# Altium schematic sheet Sheet_switch.SchDoc
size A; SheetNumber: 1; SheetTotal: 1
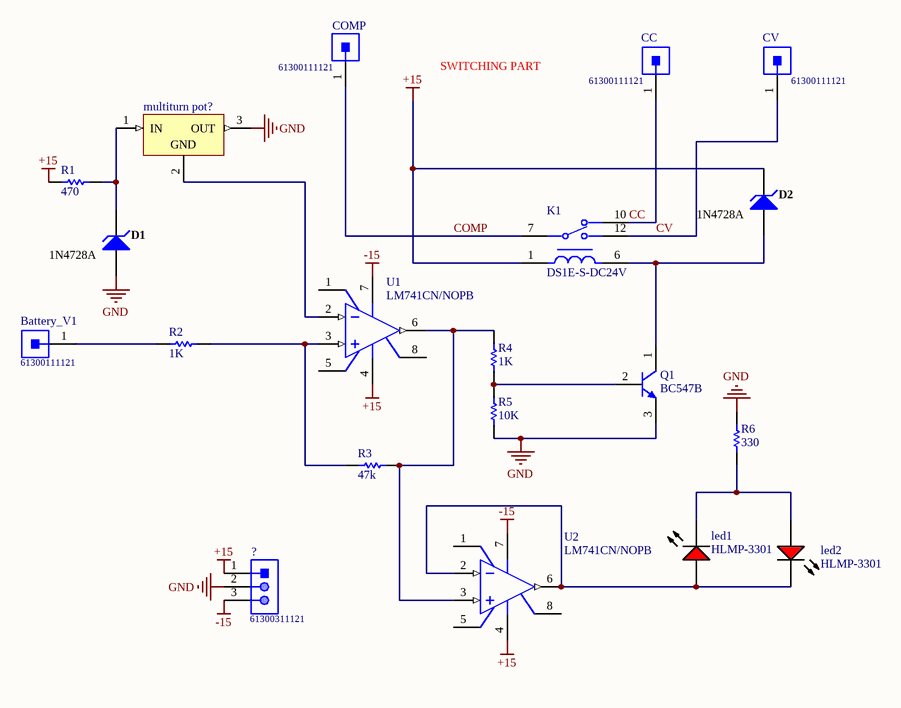
[diagram p0: Sheet_switch.SchDoc]

## Parts
?  61300311121  [61300311121]
Battery_V1  61300111121  [61300111121]
CC  61300111121  [61300111121]
COMP  61300111121  [61300111121]
CV  61300111121  [61300111121]
D1  1N4728A  [FAIR-DO-41-2_V]
D2  1N4728A  [FAIR-DO-41-2_V]
K1  DS1E-S-DC24V  [FP-DS1E-MFG]
led1  HLMP-3301  [AVAG-HLMP-3301-2]
led2  HLMP-3301  [AVAG-HLMP-3301-2]
multiturn_pot?  (no value)  [FAIR-TO-220-3]
Q1  BC547B  [ONSC-TO-92-3-29-11]
R1  470  [RESA60-630X240]
R2  1K  [RESA60-630X240]
R3  47k  [RESA60-630X240]
R4  1K  [RESA60-630X240]
R5  10K  [RESA60-630X240]
R6  330  [RESA60-630X240]
U1  LM741CN/NOPB  [P0008A]
U2  LM741CN/NOPB  [P0008A]

## Nets
+15: ?.1 D2.2(K) K1.1 R1.1 U1.4(V-) U2.4(V-)
-15: ?.3 U1.7(V+) U2.7(V+)
GND: ?.2 D1.1(A) multiturn_pot?.3(OUT) Q1.3(E) R5.1 R6.2
CC: CC.1 K1.10
COMP: COMP.1 K1.7
CV: CV.1 K1.12
NetBattery_V1_1: Battery_V1.1 R2.1
NetD1_2: D1.2(K) multiturn_pot?.1(IN) R1.2
NetD2_1: D2.1(A) K1.6 Q1.1(C)
Netled1_1: led1.1(K) led2.2(A) R6.1
Netled1_2: led1.2(A) led2.1(K) U2.2(IN-) U2.6(OUT)
Netmultiturn_pot?_2: multiturn_pot?.2(GND) U1.2(IN-)
NetQ1_2: Q1.2(B) R4.1 R5.2
NetR2_2: R2.2 R3.1 U1.3(IN+)
NetR3_2: R3.2 R4.2 U1.6(OUT) U2.3(IN+)

Not connected (* = marked no-connect by the designer): U1 1(OFS_NULL) 5(OFS_NULL) 8(NC); U2 1(OFS_NULL) 5(OFS_NULL) 8(NC)

## Notes on the sheet
- SWITCHING PART

## Library data of the parts
? = CMP-1502-01062-1: THT Vertical Pin Header WR-PHD, Pitch 2.54 mm, Single Row, 3 pins; Manufacturer: Wurth Elektronik; Withstanding Voltage: 500VAC; Working Voltage: 250VAC; Rated Current: 3A; Pitch: 2.54mm; Pin Number: 3; Gender: Male; Contact Resistance: 20mOhm; Package Reference: 61300311121; Manufacturer URL: http://www.we-online.de; Datasheet URL: https://katalog.we-online.de/em/datasheet/6130xx11121.pdf; Operating Temperature: -40to105degC; Part Number: 61300311121; Orientation: Vertical; Packaging: Bag; Row Number: Single; Mounting Technology: THT; Publisher: WurthElektronik
Battery_V1 CC COMP CV = CMP-1502-01058-1: THT Vertical Pin Header WR-PHD, Pitch 2.54 mm, Single Row, 1 pins; Manufacturer: Wurth Elektronik; Gender: Male; Working Voltage: 250VAC; Withstanding Voltage: 500VAC; Pin Number: 1; Contact Resistance: 20mOhm; Rated Current: 3A; Pitch: 2.54mm; Mounting Technology: THT; Datasheet URL: https://katalog.we-online.de/em/datasheet/6130xx11121.pdf; Manufacturer URL: http://www.we-online.de; Operating Temperature: -40to105degC; Publisher: WurthElektronik; Part Number: 61300111121; Row Number: Single; Package Reference: 61300111121; Orientation: Vertical; Packaging: Bag
D1 D2 = CMP-0892-00028-1: Zener Diode, 3.3V, 1W, 5%, -65 to 200 degC, 2-Pin DO-41, Body 2.72 x 5.2 mm, RoHS; Manufacturer: Fairchild Semiconductor; PD (W): 1; VZ (Max.) (V): 3.465; IR (uA): 100; ZZ (Max) (ohm): 10; Test Current IZ (mA): 76; VZ (Min.) (V): 3.135; DatasheetVersion: Rev. H3; Tolerance: 5%; ComponentLink3URL: http://www.fairchildsemi.com/dwg/DO/DO41A.pdf; ComponentLink2Description: Datasheet; PackageDescription: 2-Pin Axial leaded, Body 2.72 x 5.2 mm, Lead Spread 25.4 mm; PartNumber: 1N4728A; Operating and Storage Temperature Range: -65 to 200 degC; Mounting Technology: Through Hole; ComponentLink3Description: Package Specification; PackageReference: DO-41-2; ComponentLink1URL: http://www.fairchildsemi.com/; RoHS: TRUE; ComponentLink1Description: Manufacturer URL; ComponentLink2URL: http://www.fairchildsemi.com/ds/1N/1N4744A.pdf; PackageVersion: Rev. 2
K1 = CMP-05607-000039-1: RELAY GEN PURPOSE SPDT 2A 24VDC; Max Current Rating: 3A; Coil Current: 8.3mA; Relay Type: General Purpose; Coil Type: Non-Latching; Voltage Rating (AC): 250V; Coil Power: 200mW; Life (Hours): 500000Hour; Power Rating: 60W; Voltage Rating (DC): 220V; Coil Voltage (DC): 24V; Approvals: UL; Rise Time: 3ms; Operate Time: 10ms; Release Time: 5ms; Coil Resistance: 2.88kR; Number of Pins: 5; Series: DS; REACH SVHC: No SVHC; Depth: 9.9mm; Contact Material: Gold; Package Quantity: 50; Mount: Through Hole; Throw Configuration: SPDT; Max Voltage Rating (AC): 250V; Max Voltage Rating (DC): 220V; Max Operating Temperature: 70°C; Height: 9.9mm; Case/Package: DIP; Radiation Hardening: No; Packaging: Rail/Tube; Min Operating Temperature: -40°C; Current Rating: 2A; Weight: 3g; Contact Current Rating: 3A; Power Consumption: 200mW; Length: 15mm; RoHS Compliant: Yes; Lead Free: Lead Free; Width: 9.9mm; Termination: PC Pin
led1 led2 = CMP-2000-06411-1: T-1 3/4 (5 mm) Diffused LED Lamp, 1.9 V, -40 to 100 degC, 2-Pin THD, RoHS, Bulk; Manufacturer: Avago; Forward Current: 25mA; Forward Voltage: 2.4V; Peak Wavelength: 635nm; Shape Type: Circular; High Brightness: No; Main Category: StandardLED; Test Current (It): 10mA; Dominant Wave Length: 626nm; Number of  Elements: 1; Reverse Voltage: 5V; Chip Material: GaP; Product Height (mm): 9.19mm; Lens Type: ColoredDiffused; Viewing Angle: 60deg; Type: Uni-Color; Emitting Color: Red; Luminous Intensity: 5.4mcd; Power Dissipation: 85W; DELETED: Compliant; Product Depth (mm): 6.1mm; Package Description: 2-Pin Through Hole LED, Dia 5.85 mm; Mounting Technology: ThroughHole; Manufacturer URL: http://www.avagotech.com/; Package Type: T-13/4; Operating Temp Range: -40Cto100C; Datasheet URL: http://www.avagotech.com/docs/AV02-1558EN; Mounting: ThroughHole; Lens Dimensions: 5.08x5.08x8.3mm; Package Reference: HLMP-3301; Datasheet Version: 03/2015; Pin Count: 2; Packaging: TapeandReel; Operating Temperature Classification: Industrial; Lum Intensity: 5.4mcd; Rad Hardened: No; Product Length (mm): 6.1mm
multiturn_pot? = CMP-2000-04938-1: Positive Voltage Regulator, 5 V, 1 A, -40 to 125 degC, 3-Pin TO-220, RoHS, Tube; Manufacturer: FairchildSemiconductor; Maximum Input Voltage: 35V; Maximum Quiescent Current: 8mA; Load Regulation: 100mV; Maximum Output Current: 2.2(Typ)A; Output Type: Fixed; Typical Dropout Voltage @ Current: 2@1AV; Rad Hard: No; Output Voltage: 5V; Accuracy: ±4%; Number of Outputs: 1; Category: LinearRegulator; Package Description: 3-Pin Through Hole Device, Body 10 x 4.5 mm, Pitch 2.54 mm; Packaging: Rail/Tube; Mounting: ThroughHole; Polarity: Positive; Manufacturer URL: https://www.fairchildsemi.com/; Line Regulation: 100mV; Datasheet Version: Aug-12; Datasheet URL: https://datasheet.ciiva.com/26904/lm7805ct-26904988.pdf; Package Reference: TO-220; Package URL: https://www.fairchildsemi.com/package-drawings/TO/TO220B03.pdf; Package: 3TO-220AB; Operating Temperature: -40to125degC; Type: Linear
Q1 = CMP-1048-01467-1: Amplifier Transistor, NPN Silicon, 3-Pin TO-92, Bulk Box; Manufacturer: On Semiconductor; IC Continuous (A): 0.1; fT Min (MHz): 150; DatasheetVersion: Rev. 7; ComponentLink1URL: http://www.onsemi.com/; Polarity: NPN; RoHS: FALSE; ComponentLink1Description: Manufacturer URL; Packing: Bulk Box; PackageDescription: 3-Pin Transistor Outline, Body 4.825 x 3.685 mm, Pitch 1.27 mm; ComponentLink3URL: http://www.onsemi.cn/pub_link/Collateral/2N6426-D.PDF; ComponentLink2Description: Datasheet; PackageVersion: Rev. AM; PackageReference: TO-92-3-29-11_AM_SL; ComponentLink3Description: Package Specification; Mounting Technology: Through Hole; PartNumber: BC547B; ComponentLink2URL: http://www.onsemi.com/pub_link/Collateral/BC546-D.PDF
R1-R6 = CMP-1659-00075-1: Axial Resistor, 1 KOhm, +/- 1%, 250 mW, -55 to 155 degC, 2-Pin THD, RoHS, Bulk; Voltage Rating: 250 V; Resistance: 10 kohm; Power Rating: 250 mW; ComponentLink2Description: Datasheet; RoHSCompliant: true; PackageReference: MFR-25; Case\Package: Axial; Max Operating Temperature: 155 degC; DatasheetVersion: Apr-13; Tolerance: 1%; ComponentLink1URL: http://www.yageo.com/; Length: 0.248 inch; ComponentLink2URL: http://www.yageo.com/documents/recent/Yageo%20LR_MFR_2013.pdf; Packaging: Bulk; Package Quantity: 200; PackageDescription: 2-Pin Axial Lead, Dia 2.4 mm, Body Length 6.3 mm; Min Operating Temperature: -55 degC; ComponentLink1Description: Manufacturer URL
U1 U2 = CMP-0055-00162-3: Operational Amplifier, 8-pin MDIP, Pb-Free; Manufacturer: Texas Instruments; PackageTopMarking: NSUZXYTTE#*LM*741CN; PowerWise: N; CompType: Amplifiers; ComponentLink1Description: Datasheet URL; ComponentLink1URL: http://www.ti.com/general/docs/lit/getliterature.tsp?genericPartNumber=LM741&fileType=pdf; PackageDescription: MDIP, .365 x .250 x .130in, 8 Lead, .100in Pitch; RoHS: Y; PinCount: 8; Code_JEDEC: MS-001-BA; Package Reference: P0008A